# Altium schematic sheet I2C-SPI.SchDoc
size A3; SheetNumber: 15; SheetTotal: 15
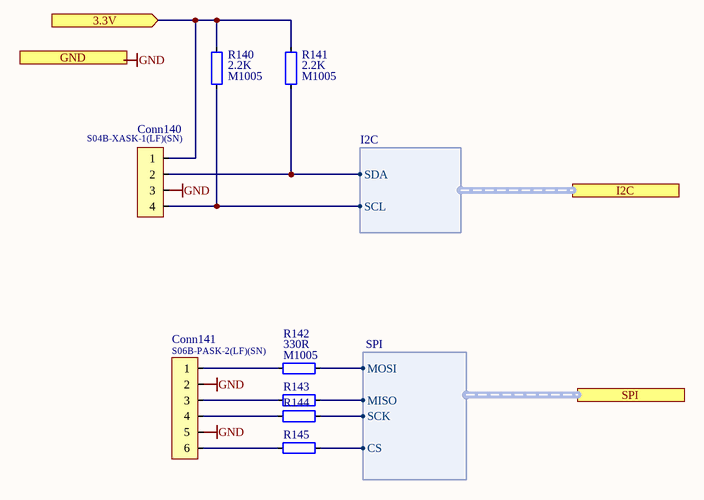
[diagram p0: I2C-SPI.SchDoc]

## Parts
Conn140  Manufacturer Part Number: S04B-XASK-1(LF)(SN)  [Connector, S04B-XASK-1]  (hidden comment: Connector - 4P)
Conn141  Manufacturer Part Number: S06B-PASK-2(LF)(SN)  [Connector, S06B-PASK-2]  (hidden comment: Connector - 6P)
R140  value 2.2K  Package: M1005  [Resistor_Smd_M1005_I0402]  (hidden comment: Resistor)
R141  value 2.2K  Package: M1005  [Resistor_Smd_M1005_I0402]  (hidden comment: Resistor)
R142  value 330R  Package: M1005  [Resistor_Smd_M1005_I0402]  (hidden comment: Resistor)
R143  Resistor  [Resistor_Smd_M1005_I0402]  (value not drawn)
R144  Resistor  [Resistor_Smd_M1005_I0402]  (value not drawn)
R145  Resistor  [Resistor_Smd_M1005_I0402]  (value not drawn)

## Ports
3.3V (in), GND (in), I2C (harness I2C), SPI (harness SPI)

## Harnesses
I2C: SDA, SCL
SPI: MOSI, MISO, SCK, CS

## Nets
GND: Conn140.3 Conn141.2 Conn141.5
3.3V: Conn140.1 R140.1 R141.1 ; port 3.3V
NetConn140_2: Conn140.2 R141.2 ; port I2C.SDA
NetConn140_4: Conn140.4 R140.2 ; port I2C.SCL
NetConn141_1: Conn141.1 R142.1
NetConn141_3: Conn141.3 R143.1
NetConn141_4: Conn141.4 R144.1
NetConn141_6: Conn141.6 R145.1
NetR142_2: R142.2 ; port SPI.MOSI
NetR143_2: R143.2 ; port SPI.MISO
NetR144_2: R144.2 ; port SPI.SCK
NetR145_2: R145.2 ; port SPI.CS

## Notes on the sheet
- Labels drawn without touching a wire or pin: GND

## Library data of the parts
Conn140 = Connector - 4P: Conn, JST, 4P, TH, XA, Side Entry; ComponentLink1Description: Datasheet; ComponentLink1URL: E:\Altium\Datasheets\Connector - JST\XA Family.pdf; ComponentLink2Description: Supplier Link; ComponentLink2URL: https://www.digikey.com/en/products/detail/jst-sales-america-inc/S04B-XASK-1-LF-SN/7230506; Supplier: Digikey; Supplier Part Number: 455-4090-ND; Manufacturer: JST; Operating Temperature, Min: -25℃; Operating Temperature, Max: +85℃; Quantity, Min: 1; Quantity, Max: 10000; Price, Min: 0.53; Supplier Currency: $; Price, Max: 0.22547; Supplier Link: https://www.digikey.com/en/products/detail/jst-sales-america-inc/S04B-XASK-1-LF-SN/7230506; Component Type: PCB; Component Category: Connector; Package: SMD, TH, Side Entry
Conn141 = Connector - 6P: Conn, JST, 6P, TH, PA, Side Entry; ComponentLink1Description: Datasheet; ComponentLink1URL: E:\Altium\Datasheets\Connector - JST\PA Family.pdf; ComponentLink2Description: Supplier Link; ComponentLink2URL: https://www.digikey.com/en/products/detail/jst-sales-america-inc/S06B-PASK-2-LF-SN/926757; Supplier: Digikey; Supplier Part Number: 455-1851-ND; Manufacturer: JST; Operating Temperature, Min: -25℃; Operating Temperature, Max: +85℃; Quantity, Min: 1; Quantity, Max: 10000; Price, Min: 0.51; Supplier Currency: $; Price, Max: 0.21423; Supplier Link: https://www.digikey.com/en/products/detail/jst-sales-america-inc/S06B-PASK-2-LF-SN/926757; Component Type: PCB; Component Category: Connector; Package: TH, Side
R140 R141 = Resistor: Res, 2.2K, 1%, M1005; Manufacturer: Yageo; Manufacturer Part Number: RC0402FR-072K2L; Component Category: Resistor; Component Type: Fixed Value; Tolerance: 1%; Supplier Link: https://www.digikey.com/en/products/detail/yageo/RC0402FR-072K2L/726553; Supplier Currency: $; Price, Max: 0.00129; Price, Min: 0.1; Quantity, Max: 100000; Quantity, Min: 1; Operating Temperature, Max: -55℃; Operating Temperature, Min: +155℃; Supplier Part Number: 311-2.20KLRCT-ND; Supplier: Digikey; ComponentLink1Description: Datasheet; ComponentLink1URL: E:\Altium\Datasheets\Resistor\Yageo - RC_L Series.pdf; ComponentLink2Description: Supplier Link; ComponentLink2URL: https://www.digikey.com/en/products/detail/yageo/RC0402FR-072K2L/726553
R142-R145 = Resistor: Res, 330R, 1%, M1005; Manufacturer: Yageo; Manufacturer Part Number: RC0402FR-07330RL; Component Category: Resistor; Component Type: Fixed Value; Tolerance: 1%; Supplier Link: https://www.digikey.com/en/products/detail/yageo/RC0402FR-07330RL/726594; Supplier Currency: $; Price, Max: 0.00129; Price, Min: 0.1; Quantity, Max: 100000; Quantity, Min: 1; Operating Temperature, Max: -55℃; Operating Temperature, Min: +155℃; Supplier Part Number: 311-330LRCT-ND; Supplier: Digikey; ComponentLink1Description: Datasheet; ComponentLink1URL: E:\Altium\Datasheets\Resistor\Yageo - RC_L Series.pdf; ComponentLink2Description: Supplier Link; ComponentLink2URL: https://www.digikey.com/en/products/detail/yageo/RC0402FR-07330RL/726594
  R143-R145: Value: 330R; Package: M1005